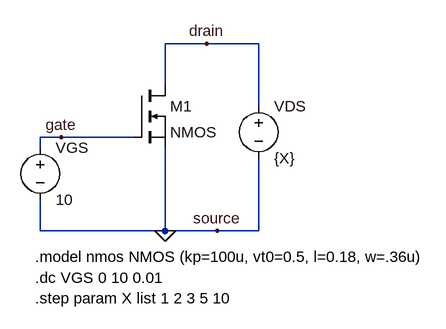
[diagram p0: schematic part2_a_2.asc]
part2_a_2.asc, the LTspice schematic file:
Version 4
SHEET 1 880 680
WIRE 160 48 96 48
WIRE 240 48 160 48
WIRE 96 112 96 48
WIRE 240 144 240 48
WIRE -64 192 -96 192
WIRE 48 192 -64 192
WIRE -96 208 -96 192
WIRE -96 336 -96 288
WIRE 96 336 96 208
WIRE 96 336 -96 336
WIRE 176 336 96 336
WIRE 240 336 240 224
WIRE 240 336 176 336
FLAG 96 336 0
FLAG -64 192 gate
FLAG 160 48 drain
FLAG 176 336 source
SYMBOL voltage -96 192 R0
SYMATTR InstName VGS
SYMATTR Value 10
SYMBOL voltage 240 128 R0
SYMATTR InstName VDS
SYMATTR Value {X}
SYMBOL nmos 48 112 R0
SYMATTR InstName M1
TEXT -104 376 Left 2 !.model nmos NMOS (kp=100u, vt0=0.5, l=0.18, w=.36u)
TEXT -104 408 Left 2 !.dc VGS 0 10 0.01
TEXT -104 440 Left 2 !.step param X list 1 2 3 5 10

The netlist it stands for:
* part2_a_2.asc
VGS gate 0 10
VDS drain 0 {X}
M1 drain gate 0 0 NMOS
.model NMOS NMOS
.model PMOS PMOS
.lib standard.mos
.model nmos NMOS (kp=100u, vt0=0.5, l=0.18, w=.36u)
.dc VGS 0 10 0.01
.step param X list 1 2 3 5 10
.backanno
.end

* Results of the author's LTspice run, read from the files saved beside the schematic
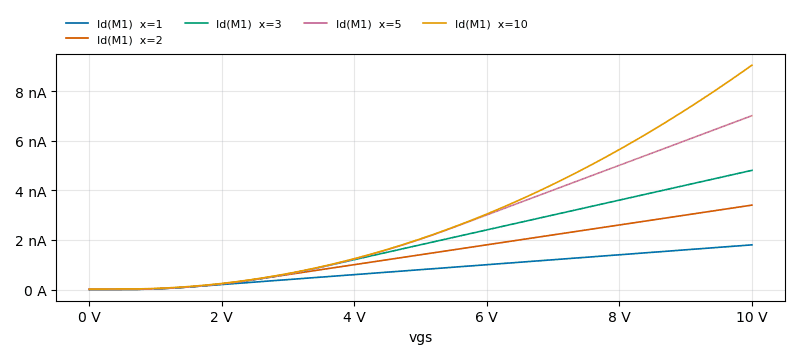
[diagram p1: DC transfer characteristic of part2_a_2.asc, plotted from the saved traces]
* DC transfer characteristic, 5 runs:
*   Id(M1) [x=1]: 2.01 pA at vgs=0 V, 1.802 nA at vgs=10 V, min 2.01 pA, max 1.802 nA
*   Id(M1) [x=2]: 4.01 pA at vgs=0 V, 3.404 nA at vgs=10 V, min 4.01 pA, max 3.404 nA
*   Id(M1) [x=3]: 6.01 pA at vgs=0 V, 4.806 nA at vgs=10 V, min 6.01 pA, max 4.806 nA
*   Id(M1) [x=5]: 10.01 pA at vgs=0 V, 7.01 nA at vgs=10 V, min 10.01 pA, max 7.01 nA
*   Id(M1) [x=10]: 20.01 pA at vgs=0 V, 9.045 nA at vgs=10 V, min 20.01 pA, max 9.045 nA